# Altium project Batarang.PrjPcb
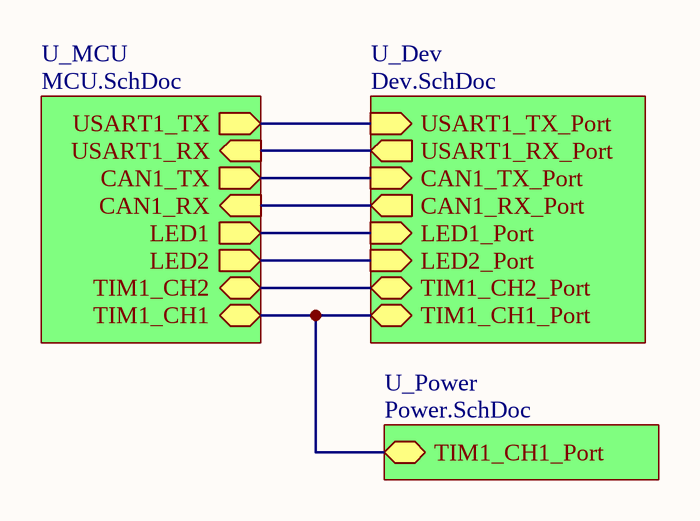
[diagram p0: Batarang.SchDoc]
4 sheets, 60 parts. Net scope: hierarchical (ports join the sheet entries above them; power ports are global).
Board file: Batarang.PcbDoc
Sheets:
  Batarang.SchDoc
    U_MCU = MCU.SchDoc
    U_Dev = Dev.SchDoc
    U_Power = Power.SchDoc

## Sheet Batarang.SchDoc
size 292 x 193 mm; Author: Power Lin; Revision: 2.0B; SheetNumber: 1; SheetTotal: 4; Website: wiki-power.com

### Sub-sheets
U_Dev = Dev.SchDoc: CAN1_RX_Port (out), CAN1_TX_Port (in), LED1_Port (in), LED2_Port (in), USART1_TX_Port (in), USART1_RX_Port (out), TIM1_CH1_Port (bidir), TIM1_CH2_Port (bidir)
U_MCU = MCU.SchDoc: USART1_TX (out), USART1_RX (in), CAN1_RX (in), CAN1_TX (out), TIM1_CH1 (bidir), TIM1_CH2 (bidir), LED1 (out), LED2 (out)
U_Power = Power.SchDoc: TIM1_CH1_Port (bidir)

### Nets
NetD2_2: sheet U_MCU/USART1_TX, sheet U_Dev/USART1_TX_Port
NetD3_2: sheet U_MCU/USART1_RX, sheet U_Dev/USART1_RX_Port
NetD4_2: sheet U_MCU/TIM1_CH1, sheet U_Dev/TIM1_CH1_Port, sheet U_Power/TIM1_CH1_Port
NetD5_2: sheet U_MCU/TIM1_CH2, sheet U_Dev/TIM1_CH2_Port
NetR7_2: sheet U_MCU/LED1, sheet U_Dev/LED1_Port
NetR8_2: sheet U_MCU/LED2, sheet U_Dev/LED2_Port
NetU1_1: sheet U_MCU/CAN1_TX, sheet U_Dev/CAN1_TX_Port
NetU1_4: sheet U_MCU/CAN1_RX, sheet U_Dev/CAN1_RX_Port

### Notes on the sheet
- Author
- DocumentName
- ModifiedDate
- ProjectName
- SheetNumber
- SheetTotal
- Website
- Revision

## Sheet MCU.SchDoc
size 292 x 193 mm; Author: Power Lin; SheetNumber: 1; SheetTotal: 1; Website: wiki-power.com
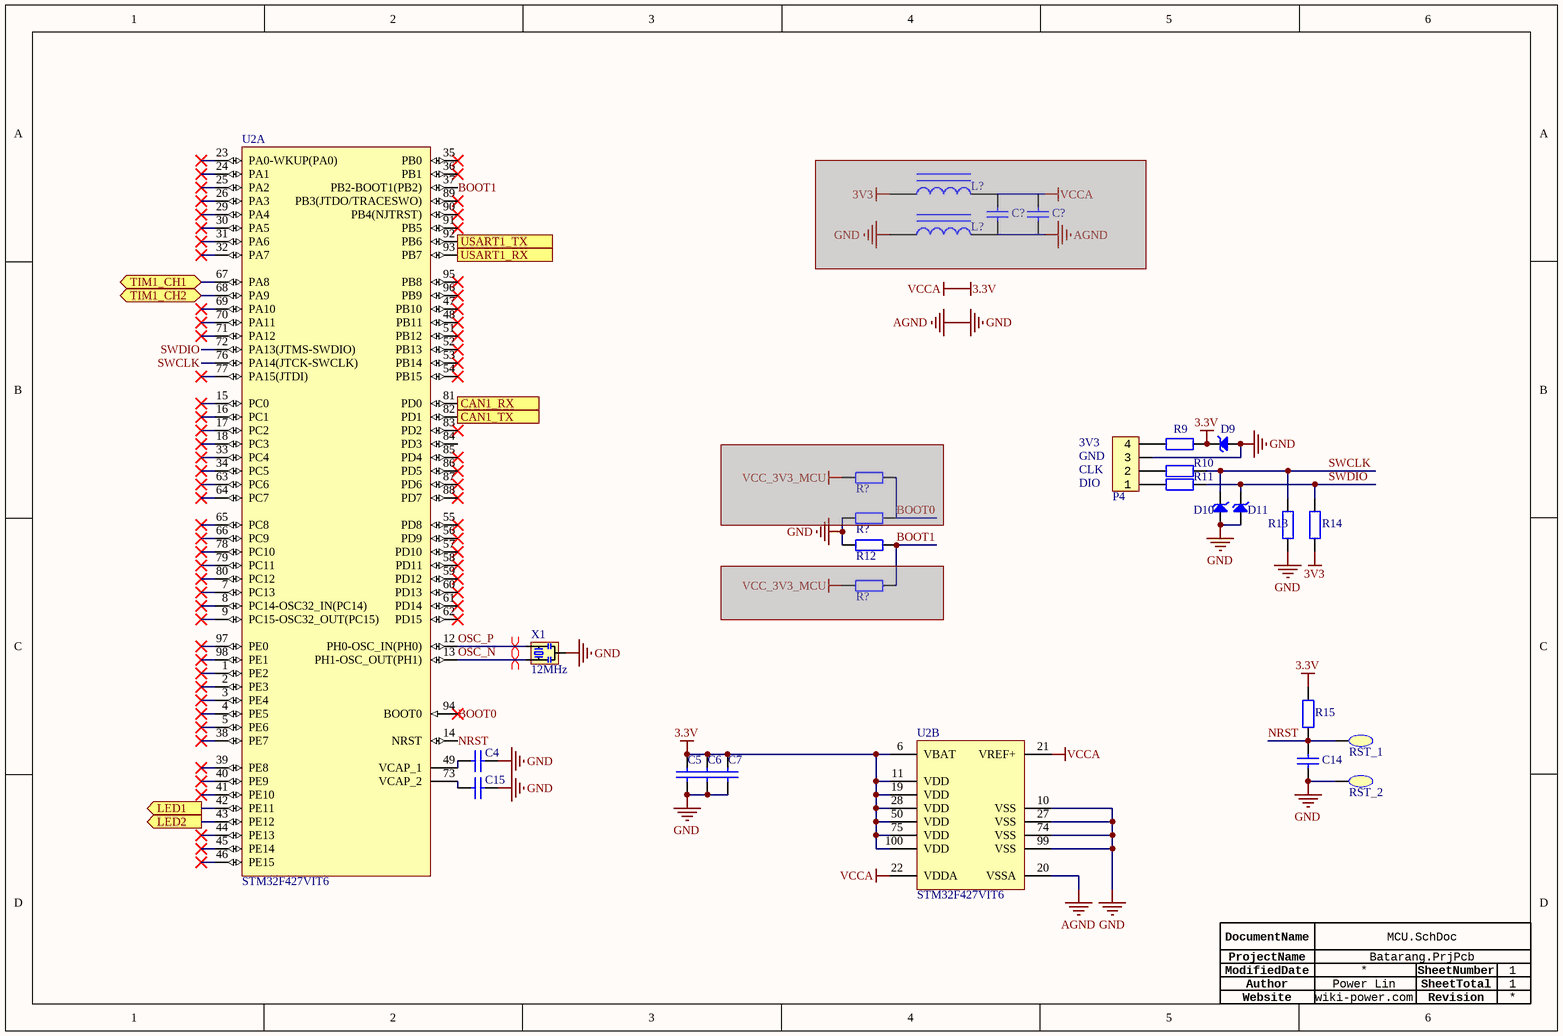
[diagram p1: MCU.SchDoc]

### Parts
(Parts that share a designator on the sheet are numbered #1, #2 ... from top to bottom, then left to right.)
C4  2.2uF  [CAP-0603]  (value not drawn)
C5  100nF  [CAP-0603]  (value not drawn)
C6  100nF  [CAP-0603]  (value not drawn)
C7  100nF  [CAP-0603]  (value not drawn)
C14  100nF  [CAP-0603]  (value not drawn)
C15  2.2uF  [CAP-0603]  (value not drawn)
C?#1  100nF  [CAP-0603]  (value not drawn)  (masked out: inside a compile mask, not in the netlist)
C?#2  1uF  [CAP-0603]  (value not drawn)  (masked out: inside a compile mask, not in the netlist)
D9  BZT52C3V9S-7-F  [SOD_323]  (value not drawn)
D10  BZT52C3V9S-7-F  [SOD_323]  (value not drawn)
D11  BZT52C3V9S-7-F  [SOD_323]  (value not drawn)
L?#1  10uH  [L-0603]  (value not drawn)  (masked out: inside a compile mask, not in the netlist)
L?#2  10uH  [L-0603]  (value not drawn)  (masked out: inside a compile mask, not in the netlist)
P4  HDR1x4_2.54  [HDR1x4_2.54_180]  (value not drawn)
R9  0R  [R-0603]  (value not drawn)
R10  100R  [R-0603]  (value not drawn)
R11  100R  [R-0603]  (value not drawn)
R12  10K  [R-0603]  (value not drawn)
R13  10K  [R-0603]  (value not drawn)
R14  10K  [R-0603]  (value not drawn)
R15  10K  [R-0603]  (value not drawn)
R?#1  NC  [R-0603]  (value not drawn)  (masked out: inside a compile mask, not in the netlist)
R?#2  10K  [R-0603]  (value not drawn)  (masked out: inside a compile mask, not in the netlist)
R?#3  NC  [R-0603]  (value not drawn)  (masked out: inside a compile mask, not in the netlist)
RST_1  TestPoint  [TestPoint]  (value not drawn)
RST_2  TestPoint  [TestPoint]  (value not drawn)
U2  STM32F427VIT6  [LQFP_100]  (parts A,B of 2)
X1  12MHz  [CSTCE_G(A)村田晶振]

### Ports
CAN1_RX (in), CAN1_TX (out), LED1 (out), LED2 (out), TIM1_CH1 (bidir), TIM1_CH2 (bidir), USART1_RX (in), USART1_TX (out)

### Nets
3.3V: C5.2 C6.2 C7.2 D9.2 R9.2 R15.2 U2.6(VBAT) U2.11(VDD) U2.19(VDD) U2.21(VREF+) U2.22(VDDA) U2.28(VDD) U2.50(VDD) U2.75(VDD) U2.100(VDD)  [also labelled VCCA]
3V3: R14.1
AGND: C4.2 C5.1 C6.1 C7.1 C14.1 C15.2 D9.1 D10.1 D11.1 P4.3 R12.1 R13.1 RST_2.1 U2.10(VSS) U2.20(VSSA) U2.27(VSS) U2.74(VSS) U2.99(VSS) X1.2(GND)  [also labelled GND]
BOOT0: U2.94(BOOT0)
BOOT1: R12.2 U2.37(PB2-BOOT1(PB2))
NRST: C14.2 R15.1 RST_1.1 U2.14(NRST)
OSC_N: U2.13(PH1-OSC_OUT(PH1)) X1.1(OSC1)
OSC_P: U2.12(PH0-OSC_IN(PH0)) X1.3(OSC2)
SWCLK: D10.2 R10.2 R13.2 U2.76(PA14(JTCK-SWCLK))
SWDIO: D11.2 R11.2 R14.2 U2.72(PA13(JTMS-SWDIO))
NetC4_1: C4.1 U2.49(VCAP_1)
NetC15_1: C15.1 U2.73(VCAP_2)
NetD2_2: U2.92(PB6) ; port USART1_TX
NetD3_2: U2.93(PB7) ; port USART1_RX
NetD4_2: U2.67(PA8) ; port TIM1_CH1
NetD5_2: U2.68(PA9) ; port TIM1_CH2
NetP4_1: P4.1 R11.1
NetP4_2: P4.2 R10.1
NetP4_4: P4.4 R9.1
NetR7_2: U2.42(PE11) ; port LED1
NetR8_2: U2.43(PE12) ; port LED2
NetU1_1: U2.82(PD1) ; port CAN1_TX
NetU1_4: U2.81(PD0) ; port CAN1_RX

Not connected (* = marked no-connect by the designer): U2 1(PE2)* 2(PE3)* 3(PE4)* 4(PE5)* 5(PE6)* 7(PC13)* 8(PC14-OSC32_IN(PC14))* 9(PC15-OSC32_OUT(PC15))* 15(PC0)* 16(PC1)* 17(PC2)* 18(PC3)* 23(PA0-WKUP(PA0))* 24(PA1)* 25(PA2)* 26(PA3)* 29(PA4)* 30(PA5)* 31(PA6)* 32(PA7)* 33(PC4)* 34(PC5)* 35(PB0)* 36(PB1)* 38(PE7)* 39(PE8)* 40(PE9)* 41(PE10)* 44(PE13)* 45(PE14)* 46(PE15)* 47(PB10)* 48(PB11)* 51(PB12)* 52(PB13)* 53(PB14)* 54(PB15)* 55(PD8)* 56(PD9)* 57(PD10)* 58(PD11)* 59(PD12)* 60(PD13)* 61(PD14)* 62(PD15)* 63(PC6)* 64(PC7)* 65(PC8)* 66(PC9)* 69(PA10)* 70(PA11)* 71(PA12)* 77(PA15(JTDI))* 78(PC10)* 79(PC11)* 80(PC12)* 83(PD2)* 84(PD3) 85(PD4)* 86(PD5)* 87(PD6)* 88(PD7)* 89(PB3(JTDO/TRACESWO))* 90(PB4(NJTRST))* 91(PB5)* 95(PB8)* 96(PB9)* 97(PE0)* 98(PE1)*

### Layout directives
differential pair: OSC_N, OSC_P

### Notes on the sheet
- (near P4) 3V3
- (near P4) GND
- (near P4) CLK
- (near P4) DIO
- Author
- DocumentName
- ModifiedDate
- ProjectName
- SheetNumber
- SheetTotal
- Website
- Revision

### Library data of the parts
C4-C7 C14 C15 C?#1 C?#2 = CAP: 贴片电容; ComponentLink1Description: 供应商链接; ComponentLink1URL: http://www.szlcsc.com/product/details_53938.html; Package: 0402; Supplier: LC; SuppliersPartNumber: C52923
D9-D11 = TVS: TVS 二极管
L?#1 L?#2 = INDUCTOR: 贴片电感; ComponentLink1Description: 供应商链接; ComponentLink1URL: http://www.szlcsc.com/product/details_33003.html; Package: 0402; Supplier: LC; SuppliersPartNumber: C32041
P4 = HDR1x4_2.54: Header
R9-R15 R?#1-R?#3 = RES: 贴片电阻; Package: 0805; Supplier: LC; SuppliersPartNumber: C17798
U2 = STM32F427Vx: 微控制器; Manufacturer: STMicroelectronics; Core: ARM Cortex-M4; D/A Converter: 2x12-bit; FLASH Size (Prog) (kB): 2048; I/Os (High Current): 82; Internal RAM Size (kB): 256; Operating Frequency(F) (Processor speed) (MHz): 168; Packing: Tray; Supply Voltage(Vcc) max (V): 3.6; Supply Voltage(Vcc) min (V): 1.8; DatasheetVersion: Rev. 1; PackageVersion: Rev. 1, 06/2013; PackageReference: LQFP100; PackageDescription: 100-Pin Low Profile Quad Flat Package, 14 x 14 mm Body, 0.5 mm Pitch; Supplier 1: Digi-Key; Supplier Part Number 1: 497-14049-ND; Supplier 2: Farnell; Supplier Part Number 2: 2333369; Supplier 3: Newark; Supplier Part Number 3: 99W9927; Supplier 4: Newark; Supplier Part Number 4: 66W7312; Supplier 5: Mouser; Supplier Part Number 5: 511-STM32F427VIT6; Mounting Technology: Surface Mount; PartNumber: STM32F427VIT6; ComponentLink1Description: Manufacturer URL; ComponentLink1URL: http://www.st.com/web/en/home.html; ComponentLink2Description: Datasheet; ComponentLink2URL: http://www.st.com/st-web-ui/static/active/en/resource/technical/document/datasheet/DM00071990.pdf; ComponentLink3Description: Package Specification; ComponentLink3URL: http://www.st.com/st-web-ui/static/active/en/resource/technical/document/data_brief/DM00071938.pdf
X1 = XTAL: 有源晶振

## Sheet Dev.SchDoc
size 292 x 193 mm; Author: Power Lin; SheetNumber: 1; SheetTotal: 1; Website: wiki-power.com
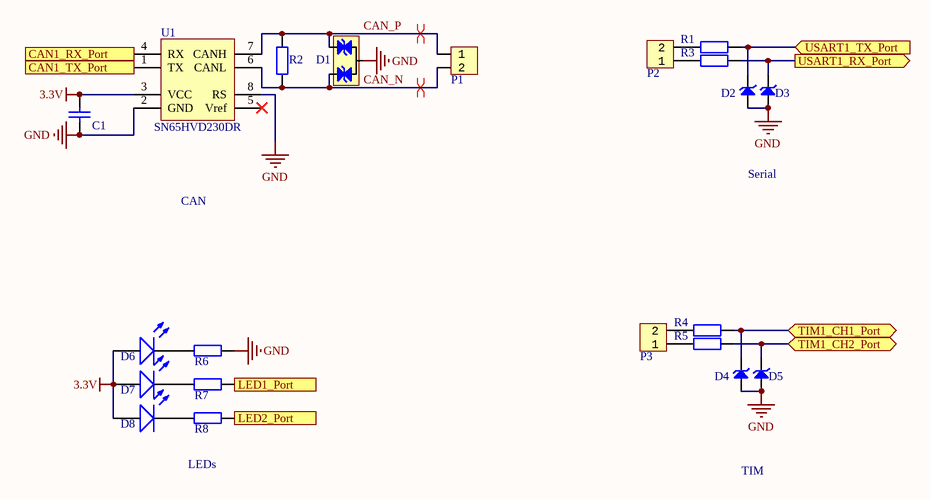
[diagram p2: Dev.SchDoc]

### Parts
C1  100nF  [CAP-0603]  (value not drawn)
D1  PESD2CAN  [SOT-23-3]  (value not drawn)
D2  BZT52C3V9S-7-F  [SOD_323]  (value not drawn)
D3  BZT52C3V9S-7-F  [SOD_323]  (value not drawn)
D4  BZT52C3V9S-7-F  [SOD_323]  (value not drawn)
D5  BZT52C3V9S-7-F  [SOD_323]  (value not drawn)
D6  RED  [LED_0603]  (value not drawn)
D7  RED  [LED_0603]  (value not drawn)
D8  GREEN  [LED_0603]  (value not drawn)
P1  HDR1x2_2.54  [HDR1X2_2.54_180]  (value not drawn)
P2  HDR1x2_2.54  [HDR1X2_2.54_180]  (value not drawn)
P3  HDR1x2_2.54  [HDR1X2_2.54_180]  (value not drawn)
R1  100R  [R-0603]  (value not drawn)
R2  120R  [R-0603]  (value not drawn)
R3  100R  [R-0603]  (value not drawn)
R4  100R  [R-0603]  (value not drawn)
R5  100R  [R-0603]  (value not drawn)
R6  4.7K  [R-0603]  (value not drawn)
R7  4.7K  [R-0603]  (value not drawn)
R8  4.7K  [R-0603]  (value not drawn)
U1  SN65HVD230DR  [SOIC_8]

### Ports
CAN1_RX_Port (out), CAN1_TX_Port (in), LED1_Port (in), LED2_Port (in), TIM1_CH1_Port (bidir), TIM1_CH2_Port (bidir), USART1_RX_Port (out), USART1_TX_Port (in)

### Nets
3.3V: C1.2 D6.A D7.A D8.A U1.3(VCC)
GND: C1.1 D1.3 D2.1 D3.1 D4.1 D5.1 R6.2 U1.2(GND) U1.8(RS)  [project net AGND]
CAN_N: D1.1 P1.2 R2.1 U1.6(CANL)
CAN_P: D1.2 P1.1 R2.2 U1.7(CANH)
NetD2_2: D2.2 R1.2 ; port USART1_TX_Port
NetD3_2: D3.2 R3.2 ; port USART1_RX_Port
NetD4_2: D4.2 R4.2 ; port TIM1_CH1_Port
NetD5_2: D5.2 R5.2 ; port TIM1_CH2_Port
NetD6_K: D6.K R6.1
NetD7_K: D7.K R7.1
NetD8_K: D8.K R8.1
NetP2_1: P2.1 R3.1
NetP2_2: P2.2 R1.1
NetP3_1: P3.1 R5.1
NetP3_2: P3.2 R4.1
NetR7_2: R7.2 ; port LED1_Port
NetR8_2: R8.2 ; port LED2_Port
NetU1_1: U1.1(TX) ; port CAN1_TX_Port
NetU1_4: U1.4(RX) ; port CAN1_RX_Port

Not connected (* = marked no-connect by the designer): U1 5(Vref)*

### Layout directives
differential pair: CAN_N, CAN_P

### Notes on the sheet
- CAN
- Serial
- LEDs
- TIM
- Author
- DocumentName
- ModifiedDate
- ProjectName
- SheetNumber
- SheetTotal
- Website
- Revision

### Library data of the parts
C1 = CAP: 贴片电容; ComponentLink1Description: 供应商链接; ComponentLink1URL: http://www.szlcsc.com/product/details_53938.html; Package: 0402; Supplier: LC; SuppliersPartNumber: C52923
D1 = TVS_C2: TVS 双向x2
D2-D5 = TVS: TVS 二极管
D6-D8 = LED: 发光二极管; ComponentLink1Description: 供应商链接; ComponentLink1URL: http://www.szlcsc.com/product/details_2663.html; Package: 0603; Supplier: LC; SuppliersPartNumber: C2290
P1-P3 = HDR1x2_2.54: Header
R1-R8 = RES: 贴片电阻; Package: 0805; Supplier: LC; SuppliersPartNumber: C17798
U1 = SN65HVD230DR: CAN 控制器（3.3V）

## Sheet Power.SchDoc
size 292 x 193 mm; Author: Power Lin; SheetNumber: 1; SheetTotal: 1; Website: wiki-power.com
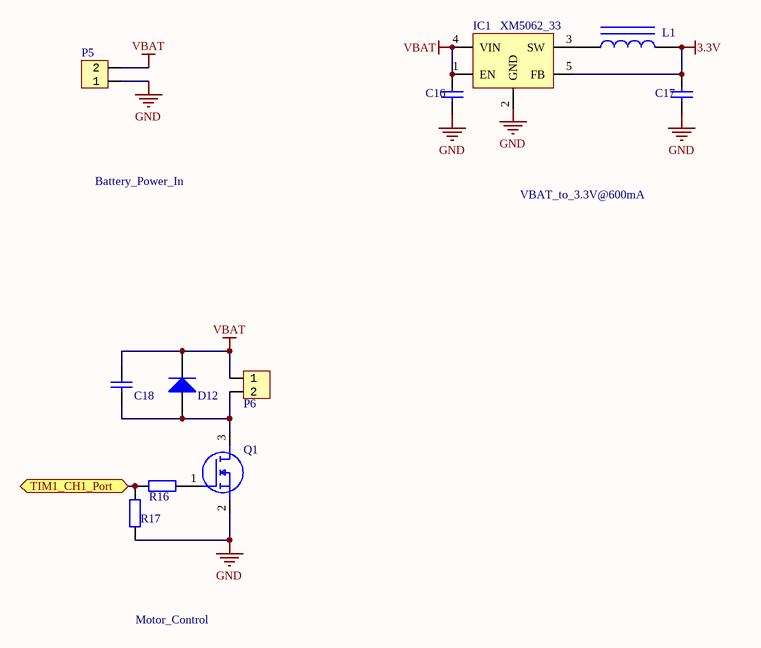
[diagram p3: Power.SchDoc]

### Parts
C16  4.7uF  [CAP-0603]  (value not drawn)
C17  10uF  [CAP-0603]  (value not drawn)
C18  10uF  [CAP-0603]  (value not drawn)
D12  SS14  [DO-214AC_SMA]  (value not drawn)
IC1  XM5062_33  [SOT-23-5]
L1  2.2uH  [XAL6060-103MEB]  (value not drawn)
P5  HDR1x2_2.54  [HDR1X2_2.54_180]  (value not drawn)
P6  HDR1x2_2.54  [HDR1X2_2.54_180]  (value not drawn)
Q1  SI2302DS  [SOT-23-3]  (value not drawn)
R16  22R  [R-0603]  (value not drawn)
R17  10K  [R-0603]  (value not drawn)

### Ports
TIM1_CH1_Port (bidir)

### Nets
3.3V: C17.2 IC1.5(FB) L1.2
GND: C16.1 C17.1 IC1.2(GND) P5.1 Q1.2(S) R17.1  [project net AGND]
VBAT: C16.2 C18.2 D12.2(K) IC1.1(EN) IC1.4(VIN) P5.2 P6.1
NetC18_1: C18.1 D12.1(A) P6.2 Q1.3(D)
NetD4_2: R16.1 R17.2 ; port TIM1_CH1_Port
NetIC1_3: IC1.3(SW) L1.1
NetQ1_1: Q1.1(G) R16.2

### Notes on the sheet
- Battery_Power_In
- VBAT_to_3.3V@600mA
- Motor_Control
- Author
- DocumentName
- ModifiedDate
- ProjectName
- SheetNumber
- SheetTotal
- Website
- Revision

### Library data of the parts
C16-C18 = CAP: 贴片电容; ComponentLink1Description: 供应商链接; ComponentLink1URL: http://www.szlcsc.com/product/details_53938.html; Package: 0402; Supplier: LC; SuppliersPartNumber: C52923
D12 = DIODE: 二极管; ComponentLink1Description: 供应商链接; ComponentLink1URL: http://www.szlcsc.com/product/details_23178.html; Package: SMA(DO-214AC); Supplier: LC; SuppliersPartNumber: C22452
IC1 = XM5062: 降压转换芯片; Manufacturer_Name: TE Connectivity; Manufacturer_Part_Number: 1-1393258-5; Datasheet Link: http://www.te.com/commerce/DocumentDelivery/DDEController?Action=showdoc&DocId=Data+Sheet%7FSR2M%7F1116%7Fpdf%7FEnglish%7FENG_DS_SR2M_1116.pdf%7F1-1393258-5; Height: 25mm
L1 = INDUCTOR: 贴片电感; ComponentLink1Description: 供应商链接; ComponentLink1URL: http://www.szlcsc.com/product/details_33003.html; Package: 0402; Supplier: LC; SuppliersPartNumber: C32041
P5 P6 = HDR1x2_2.54: Header
Q1 = N-MOS: N 沟道 MOS; Manufacturer_Name: Nexperia; Datasheet Link: https://assets.nexperia.com/documents/data-sheet/SI2302DS.pdf; Height: 1.1mm; Manufacturer_Part_Number: SI2302DS; Mouser Part Number: N/A; Mouser Price/Stock: https://www.mouser.com/Search/Refine.aspx?Keyword=N%2FA; RS Part Number: 7983053P; RS Price/Stock: http://uk.rs-online.com/web/p/products/7983053P
R16 R17 = RES: 贴片电阻; Package: 0805; Supplier: LC; SuppliersPartNumber: C17798

## Nets that join several sheets
3.3V: MCU (15 pins), Dev (5 pins), Power (C17.2 IC1.5 L1.2)
AGND: MCU (19 pins), Dev (9 pins), Power (6 pins)
NetD2_2: MCU (U2.92), Dev (D2.2 R1.2)
NetD3_2: MCU (U2.93), Dev (D3.2 R3.2)
NetD4_2: MCU (U2.67), Dev (D4.2 R4.2), Power (R16.1 R17.2)
NetD5_2: MCU (U2.68), Dev (D5.2 R5.2)
NetR7_2: MCU (U2.42), Dev (R7.2)
NetR8_2: MCU (U2.43), Dev (R8.2)
NetU1_1: MCU (U2.82), Dev (U1.1)
NetU1_4: MCU (U2.81), Dev (U1.4)